# Altium schematic sheet SysP_Uebersicht.SchDoc: SysP17_Team10: Übersicht
size A4; CheckedBy: U. Hauser; Author: N. Dürr / M. Mettler; CompanyName: NTB; Organization: NTB Interstate University of Applied; Address1: Werdenbergstrasse 4; Address3: 9471 Buchs; Address4: Switzerland; SheetNumber: 1; SheetTotal: 5; Organization1: Sciences of Technology Buchs; Size: A4; ShortDescription: Schema-Übersicht der ganzen Elektronik
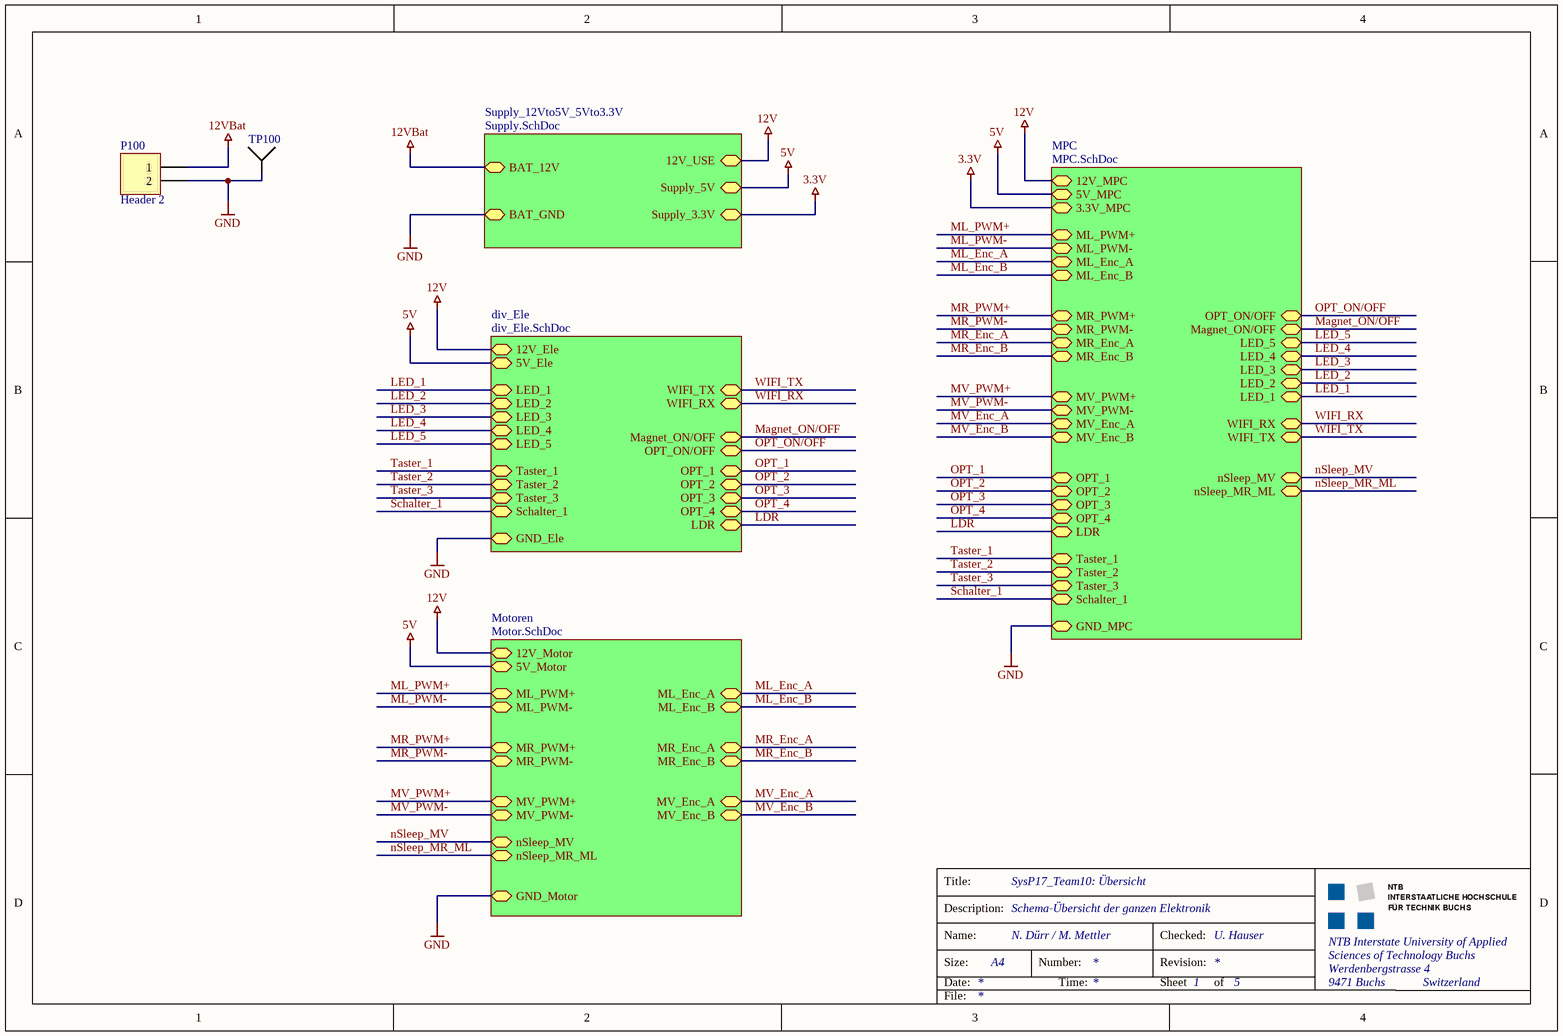
[diagram p0: SysP_Uebersicht.SchDoc]

## Parts
P100  Header 2  [Connector_Bat_2]
TP100  Testpunkt 1mm  [GEN_TP-THT-1.1mm_1_H]  (value not drawn)

## Sub-sheets
div_Ele = div_Ele.SchDoc: LED_1, LED_2, LED_3, LED_4, LED_5, Taster_1, Taster_2, Taster_3, Schalter_1, WIFI_TX, WIFI_RX, Magnet_ON/OFF, OPT_ON/OFF, OPT_1, OPT_2, OPT_3, OPT_4, LDR, GND_Ele, 12V_Ele, 5V_Ele
Motoren = Motor.SchDoc: ML_PWM+, ML_PWM-, ML_Enc_A, ML_Enc_B, MR_PWM+, MR_PWM-, MR_Enc_A, MR_Enc_B, MV_PWM+, MV_PWM-, MV_Enc_A, MV_Enc_B, 12V_Motor, 5V_Motor, GND_Motor, nSleep_MV, nSleep_MR_ML
MPC = MPC.SchDoc: ML_PWM+, ML_PWM-, ML_Enc_A, ML_Enc_B, MR_PWM+, MR_PWM-, MR_Enc_A, MR_Enc_B, MV_PWM+, MV_PWM-, MV_Enc_A, MV_Enc_B, OPT_1, OPT_2, OPT_3, OPT_4, OPT_ON/OFF, Taster_1, Taster_2, Taster_3, Schalter_1, Magnet_ON/OFF, LED_5, LED_4, LED_3, LED_2, LED_1, WIFI_TX, WIFI_RX, LDR, 12V_MPC, 5V_MPC, 3.3V_MPC, GND_MPC, nSleep_MV, nSleep_MR_ML
Supply_12Vto5V_5Vto3.3V = Supply.SchDoc: BAT_12V, BAT_GND, Supply_5V, Supply_3.3V, 12V_USE

## Nets
3.3V: sheet Supply_12Vto5V_5Vto3.3V/Supply_3.3V, sheet MPC/3.3V_MPC
5V: sheet Supply_12Vto5V_5Vto3.3V/Supply_5V, sheet div_Ele/5V_Ele, sheet Motoren/5V_Motor, sheet MPC/5V_MPC
12V: sheet Supply_12Vto5V_5Vto3.3V/12V_USE, sheet div_Ele/12V_Ele, sheet Motoren/12V_Motor, sheet MPC/12V_MPC
12VBat: P100.1 ; sheet Supply_12Vto5V_5Vto3.3V/BAT_12V
GND: P100.2 TP100.1 ; sheet Supply_12Vto5V_5Vto3.3V/BAT_GND, sheet div_Ele/GND_Ele, sheet Motoren/GND_Motor, sheet MPC/GND_MPC
LDR: sheet div_Ele/LDR, sheet MPC/LDR
LED_1: sheet div_Ele/LED_1, sheet MPC/LED_1
LED_2: sheet div_Ele/LED_2, sheet MPC/LED_2
LED_3: sheet div_Ele/LED_3, sheet MPC/LED_3
LED_4: sheet div_Ele/LED_4, sheet MPC/LED_4
LED_5: sheet div_Ele/LED_5, sheet MPC/LED_5
Magnet_ON/OFF: sheet div_Ele/Magnet_ON/OFF, sheet MPC/Magnet_ON/OFF
ML_Enc_A: sheet Motoren/ML_Enc_A, sheet MPC/ML_Enc_A
ML_Enc_B: sheet Motoren/ML_Enc_B, sheet MPC/ML_Enc_B
ML_PWM+: sheet Motoren/ML_PWM+, sheet MPC/ML_PWM+
ML_PWM-: sheet Motoren/ML_PWM-, sheet MPC/ML_PWM-
MR_Enc_A: sheet Motoren/MR_Enc_A, sheet MPC/MR_Enc_A
MR_Enc_B: sheet Motoren/MR_Enc_B, sheet MPC/MR_Enc_B
MR_PWM+: sheet Motoren/MR_PWM+, sheet MPC/MR_PWM+
MR_PWM-: sheet Motoren/MR_PWM-, sheet MPC/MR_PWM-
MV_Enc_A: sheet Motoren/MV_Enc_A, sheet MPC/MV_Enc_A
MV_Enc_B: sheet Motoren/MV_Enc_B, sheet MPC/MV_Enc_B
MV_PWM+: sheet Motoren/MV_PWM+, sheet MPC/MV_PWM+
MV_PWM-: sheet Motoren/MV_PWM-, sheet MPC/MV_PWM-
nSleep_MR_ML: sheet Motoren/nSleep_MR_ML, sheet MPC/nSleep_MR_ML
nSleep_MV: sheet Motoren/nSleep_MV, sheet MPC/nSleep_MV
OPT_1: sheet div_Ele/OPT_1, sheet MPC/OPT_1
OPT_2: sheet div_Ele/OPT_2, sheet MPC/OPT_2
OPT_3: sheet div_Ele/OPT_3, sheet MPC/OPT_3
OPT_4: sheet div_Ele/OPT_4, sheet MPC/OPT_4
OPT_ON/OFF: sheet div_Ele/OPT_ON/OFF, sheet MPC/OPT_ON/OFF
Schalter_1: sheet div_Ele/Schalter_1, sheet MPC/Schalter_1
Taster_1: sheet div_Ele/Taster_1, sheet MPC/Taster_1
Taster_2: sheet div_Ele/Taster_2, sheet MPC/Taster_2
Taster_3: sheet div_Ele/Taster_3, sheet MPC/Taster_3
WIFI_RX: sheet div_Ele/WIFI_RX, sheet MPC/WIFI_RX
WIFI_TX: sheet div_Ele/WIFI_TX, sheet MPC/WIFI_TX

## Notes on the sheet
- Title:
- Description:
- Size:
- Date:
- Name:
- Number:
- Time:
- Revision:
- Sheet
- Checked:
- of
- File:

## Library data of the parts
P100 = Header 2: Header, 2-Pin; LatestRevisionDate: 17-Jul-2002; LatestRevisionNote: Re-released for DXP Platform.; Publisher: Altium Limited
TP100 = Testpunkt 1mm: Manufacturer: Keystone Electronics; #Class: Connector; #ClassSub: Laborbuchse; Publisher: B.Sc. Ursella; Published: 2008-12-16; Supplier 1: Mouser; Supplier Part Number 1: 534-1035; Status: nLager; FootprintRef: GEN_TP-THT-1.1mm_1_H; RefFootprint: GEN_TP-THT-1.1mm_1_H; RefFileFOO: *; RefFileSCH: *; RefSchema: Testpunkt 1mm